# Altium schematic sheet Power Management.SchDoc: NER A Size Template
size Tabloid; ApprovedBy: WS; DrawnBy: Cameron Gordon; Address4: X.X.X; Revision: 1; SheetNumber: 2; SheetTotal: 3
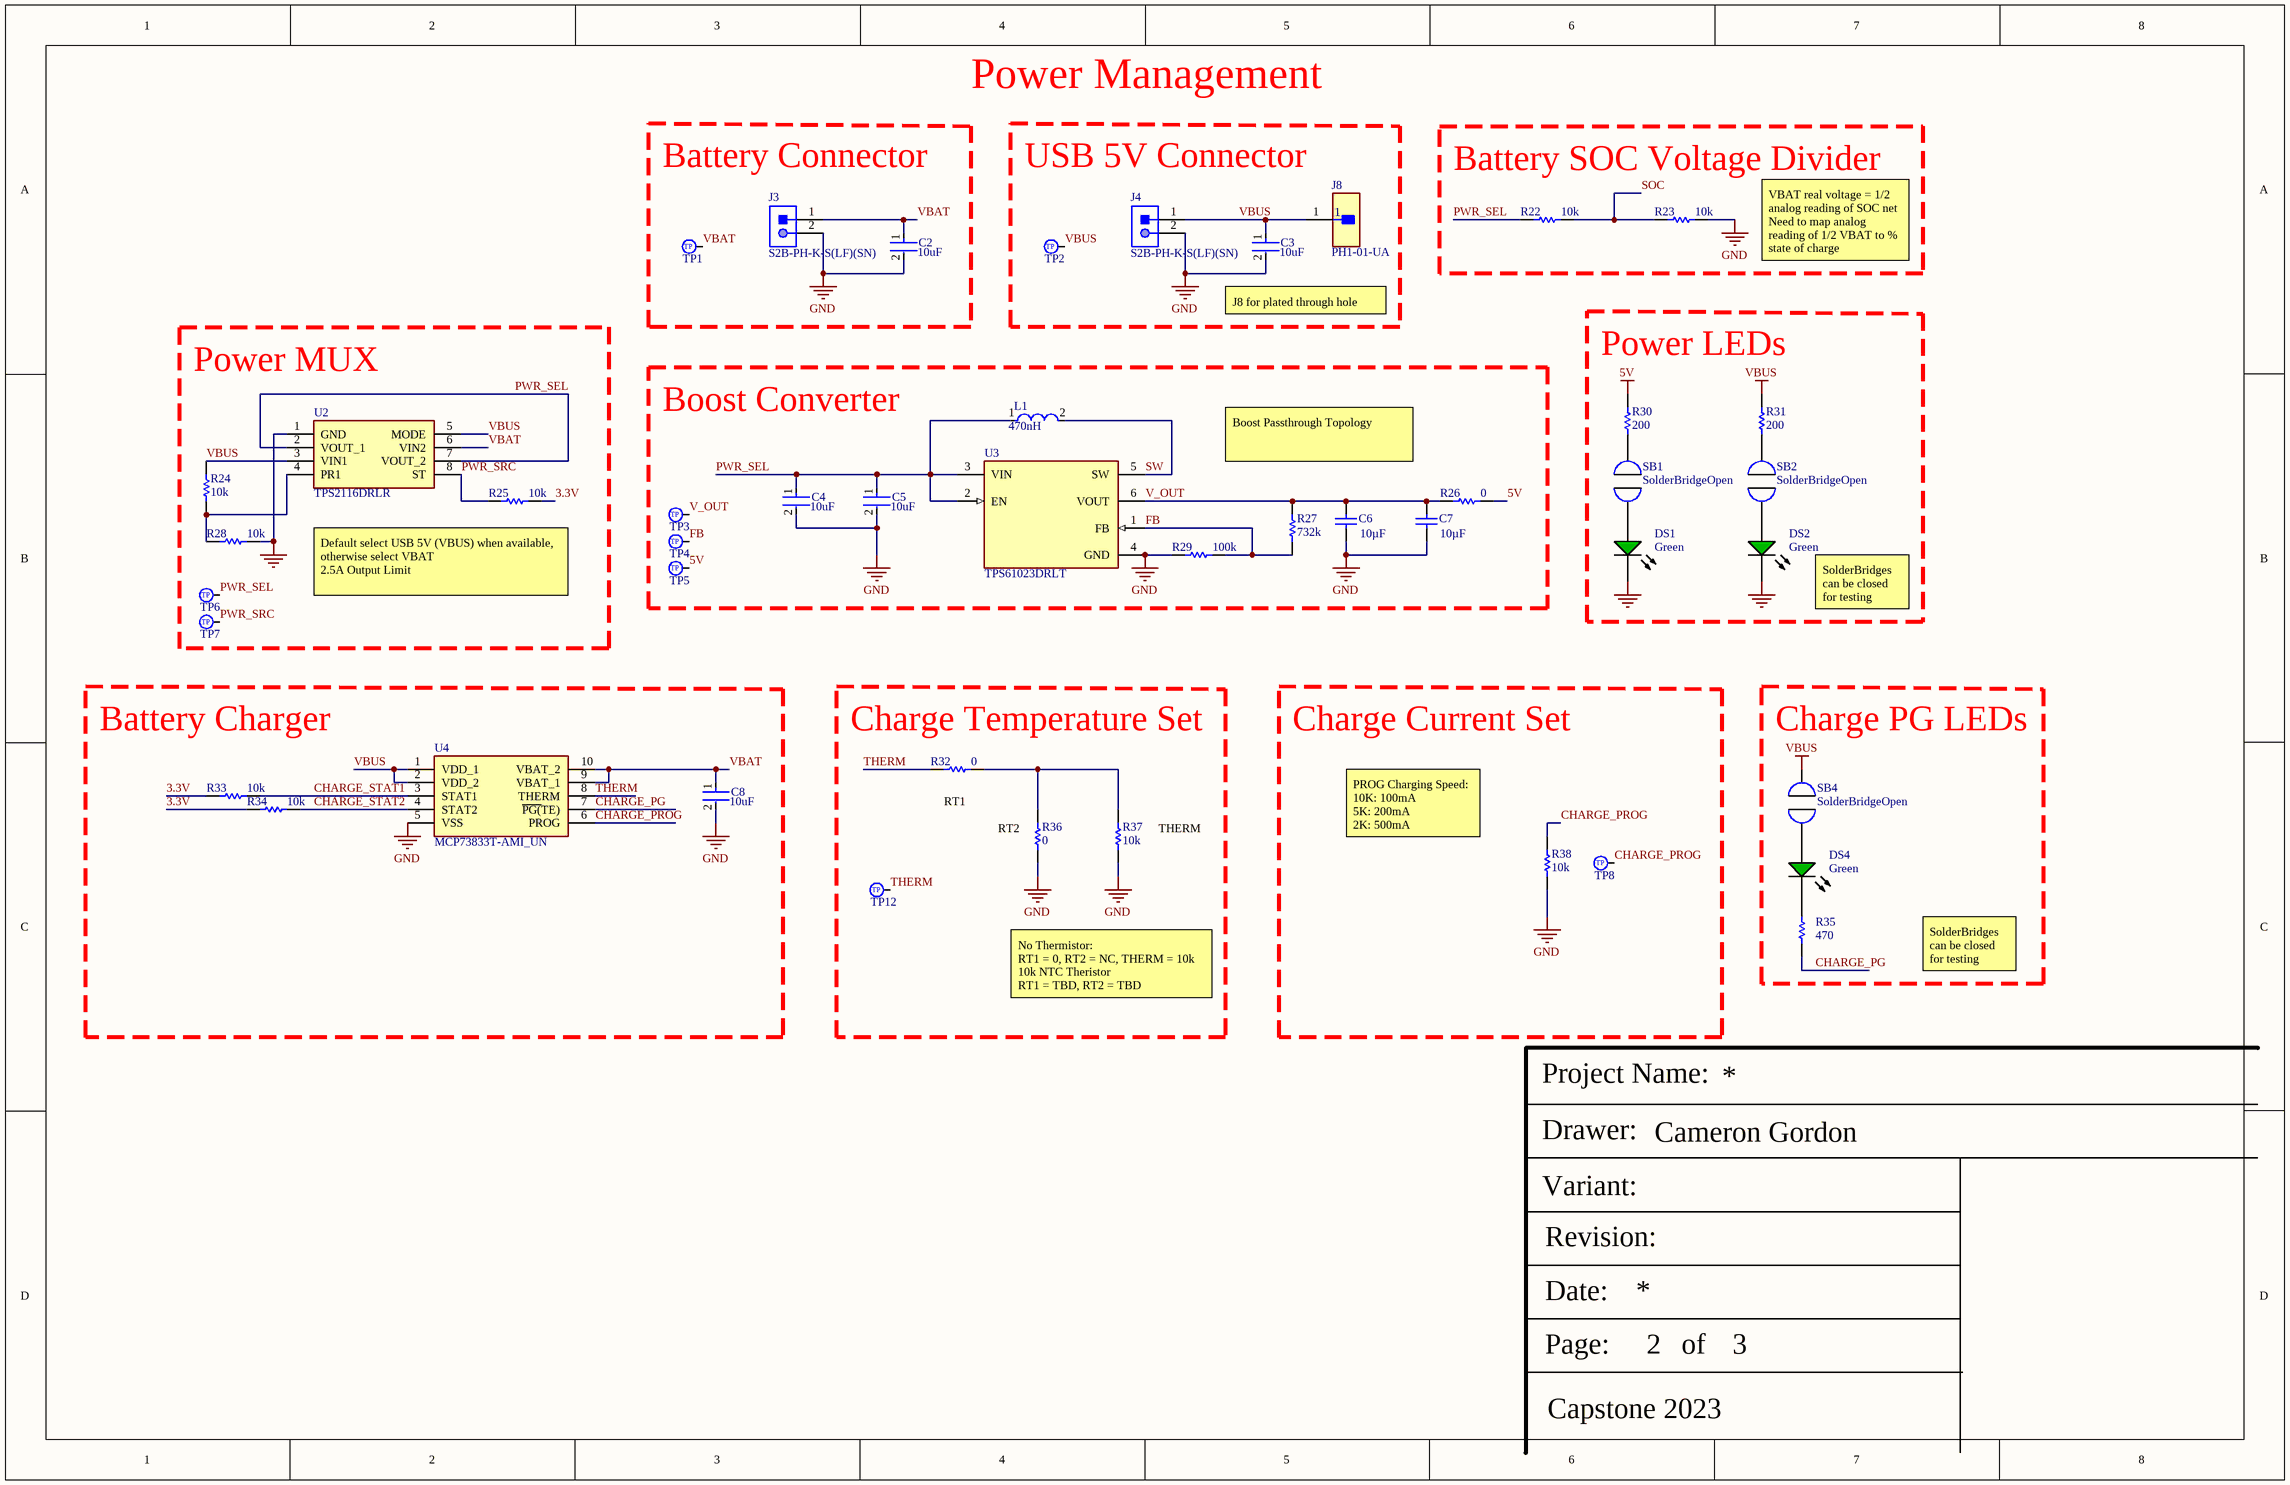
[diagram p0: Power Management.SchDoc]

## Parts
C2  value 10uF  [FP-C0805C-DG-MFG]  (hidden comment: C0805C106K8PACTU)
C3  value 10uF  [FP-C0805C-DG-MFG]  (hidden comment: C0805C106K8PACTU)
C4  value 10uF  [FP-C0805C-DG-MFG]  (hidden comment: C0805C106K8PACTU)
C5  value 10uF  [FP-C0805C-DG-MFG]  (hidden comment: C0805C106K8PACTU)
C6  Capacitance: 10µF  [CAPC3216X180X55LL20T25]  (hidden comment: GRM31CR71C106KAC7L)
C7  Capacitance: 10µF  [CAPC3216X180X55LL20T25]  (hidden comment: GRM31CR71C106KAC7L)
C8  value 10uF  [FP-C0805C-DG-MFG]  (hidden comment: C0805C106K8PACTU)
DS1  Color: Green  [LUMX-SML-LXT0805_V]  (hidden comment: SML-LXT0805GW-TR)
DS2  Color: Green  [LUMX-SML-LXT0805_V]  (hidden comment: SML-LXT0805GW-TR)
DS4  Color: Green  [LUMX-SML-LXT0805_V]  (hidden comment: SML-LXT0805GW-TR)
J3  S2B-PH-K-S(LF)(SN)  [JST-S2B-PH-K-S_V]
J4  S2B-PH-K-S(LF)(SN)  [JST-S2B-PH-K-S_V]
J8  PH1-01-UA  [FP-PH1-01-UA-MFG]
L1  Inductance: 470nH  [FP-IHLP-1212AE-11-MFG]  (hidden comment: IHLP1212AEERR47M11)
R22  Resistance: 10k  [RESC1609X55X30LL15T15]  (hidden comment: ERJ3EKF1002V)
R23  Resistance: 10k  [RESC1609X55X30LL15T15]  (hidden comment: ERJ3EKF1002V)
R24  Resistance: 10k  [RESC1609X55X30LL15T15]  (hidden comment: ERJ3EKF1002V)
R25  Resistance: 10k  [RESC1609X55X30LL15T15]  (hidden comment: ERJ3EKF1002V)
R26  Resistance: 0  [RESC1608X55X25ML10T15]  (hidden comment: RC0603JR-070RL)
R27  value 732k  [RESC1608X55X30LL15T15]  (hidden comment: ERJ-3EKF5232V)
R28  Resistance: 10k  [RESC1609X55X30LL15T15]  (hidden comment: ERJ3EKF1002V)
R29  value 100k  [RESC1608X55X30ML15T15]  (hidden comment: ERJ-3EKF1003V)
R30  value 200  [RESC2013X60X35ML10T20]  (hidden comment: RC0805JR-07200RL)
R31  value 200  [RESC2013X60X35ML10T20]  (hidden comment: RC0805JR-07200RL)
R32  Resistance: 0  [RESC1608X55X25ML10T15]  (hidden comment: RC0603JR-070RL)
R33  Resistance: 10k  [RESC1609X55X30LL15T15]  (hidden comment: ERJ3EKF1002V)
R34  Resistance: 10k  [RESC1609X55X30LL15T15]  (hidden comment: ERJ3EKF1002V)
R35  value 470  [RESC1608X55X30NL15T15]  (hidden comment: ERJ-3GEYJ471V)
R36  Resistance: 0  [RESC1608X55X25ML10T15]  (hidden comment: RC0603JR-070RL)
R37  Resistance: 10k  [RESC1609X55X30LL15T15]  (hidden comment: ERJ3EKF1002V)
R38  Resistance: 10k  [RESC1609X55X30LL15T15]  (hidden comment: ERJ3EKF1002V)
SB1  SolderBridgeOpen  [SOLDERBRIDGEOPEN]
SB2  SolderBridgeOpen  [SOLDERBRIDGEOPEN]
SB4  SolderBridgeOpen  [SOLDERBRIDGEOPEN]
TP1  0.040" Circular Test Point  [40 mil Circular Test Point]  (value not drawn)
TP2  0.040" Circular Test Point  [40 mil Circular Test Point]  (value not drawn)
TP3  0.040" Circular Test Point  [40 mil Circular Test Point]  (value not drawn)
TP4  0.040" Circular Test Point  [40 mil Circular Test Point]  (value not drawn)
TP5  0.040" Circular Test Point  [40 mil Circular Test Point]  (value not drawn)
TP6  0.040" Circular Test Point  [40 mil Circular Test Point]  (value not drawn)
TP7  0.040" Circular Test Point  [40 mil Circular Test Point]  (value not drawn)
TP8  0.040" Circular Test Point  [40 mil Circular Test Point]  (value not drawn)
TP12  0.040" Circular Test Point  [40 mil Circular Test Point]  (value not drawn)
U2  TPS2116DRLR  [SOTFL50P160X60-8N]
U3  TPS61023DRLT  [FP-DRL0006A-MFG]
U4  MCP73833T-AMI_UN  [SOP50P490X110-10N]

## Blocks framed on the sheet
Battery Connector: C2 J3 TP1
USB 5V Connector: C3 J4 J8 TP2
Battery SOC Voltage Divider: R22 R23
Power MUX: R24 R25 R28 TP6 TP7 U2
Power LEDs: DS1 DS2 R30 R31 SB1 SB2
Boost Converter: C4-C7 L1 R26 R27 R29 TP3-TP5 U3
Battery Charger: C8 R33 R34 U4
Charge Temperature Set: R32 R36 R37 TP12
Charge Current Set: R38 TP8
Charge PG LEDs: DS4 R35 SB4

## Nets
5V: R26.1 R30.2 TP5.1
GND: C2.2 C3.2 C4.2 C5.2 C6.1 C7.1 C8.2 DS1.2(K) DS2.2(K) J3.2 J4.2 R23.2 R28.2 R29.1 R36.2 R37.1 R38.1 U2.1(GND) U3.4(GND) U4.5(VSS)
VBUS: C3.1 J4.1 J8.1 R24.2 R31.2 SB4.2 TP2.1 U2.3(VIN1) U2.5(MODE) U4.1(VDD_1) U4.2(VDD_2)
3.3V: R25.2 R33.1 R34.1
CHARGE_PG: R35.1 U4.7(~{PG(}TE))
CHARGE_PROG: R38.2 TP8.1 U4.6(PROG)
CHARGE_STAT1: R33.2 U4.3(STAT1)
CHARGE_STAT2: R34.2 U4.4(STAT2)
FB: R27.1 R29.2 TP4.1 U3.1(FB)
PWR_SEL: C4.1 C5.1 L1.1 R22.1 TP6.1 U2.2(VOUT_1) U2.7(VOUT_2) U3.2(EN) U3.3(VIN)
PWR_SRC: R25.1 TP7.1 U2.8(ST)
SOC: R22.2 R23.1
SW: L1.2 U3.5(SW)
THERM: R32.2 TP12.1 U4.8(THERM)
V_OUT: C6.2 C7.2 R26.2 R27.2 TP3.1 U3.6(VOUT)
VBAT: C2.1 C8.1 J3.1 TP1.1 U2.6(VIN2) U4.9(VBAT_1) U4.10(VBAT_2)
NetDS1_1: DS1.1(A) SB1.1
NetDS2_1: DS2.1(A) SB2.1
NetDS4_1: DS4.1(A) SB4.1
NetDS4_2: DS4.2(K) R35.2
NetR24_1: R24.1 R28.1 U2.4(PR1)
NetR30_1: R30.1 SB1.2
NetR31_1: R31.1 SB2.2
NetR32_1: R32.1 R36.1 R37.2

## Notes on the sheet
- Power Management
- VBAT real voltage = 1/2 analog reading of SOC net
  Need to map analog reading of 1/2 VBAT to % state of charge
- (near C3) J8 for plated through hole
- Boost Passthrough Topology
- (near R25) Default select USB 5V (VBUS) when available, otherwise select VBAT
  2.5A Output Limit
- SolderBridges can be closed for testing
- (near R32) RT1
- (near R36) RT2
- (near R37) THERM
- PROG Charging Speed:
  10K: 100mA
  5K: 200mA
  2K: 500mA
- No Thermistor:
  RT1 = 0, RT2 = NC, THERM = 10k
  10k NTC Theristor
  RT1 = TBD, RT2 = TBD
- Project Name:
- Drawer:
- Variant:
- Revision:
- Date:
- Page:
- of
- Capstone 2023
- (in symbol CMP-00017-2) TP

## Library data of the parts
C2-C5 C8 = CMP-2007-03243-2: CAP CER 10UF 10V X5R 0805; Manufacturer: Kemet; 3DS Part Number: 220-00001; Tolerance: 10%; Temperature Coefficient: 15%; Material: Ceramic; Device Class L2: Capacitors; Device Class L1: Passive Components; ComponentLink2URL: https://content.kemet.com/datasheets/KEM_C1006_X5R_SMD.pdf; Height: 1.4mm; Lead Free: Yes; Manufacturer Part Number: C0805C106K8PACTU; Digikey Description: CAP CER 10UF 10V X5R 0805; Octopart: https://octopart.com/c0805c106k8pactu-kemet-98697; Capacitance: 10uF; Temperature Range Low: -55°C; Temperature: -55°C to +85°C; Automotive: No; Mouser Description: CAP CER 10UF 10V X5R 0805; Ipc Land Pattern Name: CAPC200125X125; Temperature Range High: +85°C; Voltage: 10V; RoHS: TRUE; Device Class L3: Ceramic Capacitors; ComponentLink2Description: Datasheet; Voltage Rating: 10V; Package: C0805C-DG; Temperature Characteristic: X5R; Category: Cap
C6 C7 = CMP-2000-06352-1: Chip Capacitor, 10 uF, +/- 10%, 16 V, -55 to 125 degC, 1206 (3216 Metric), RoHS, Tape and Reel; Manufacturer: Murata; Other Names: 490-3911-6; Product Training Modules: High-CapMultilayerCeramicCapacitors; Temperature Coefficient: X7R; Catalog Drawings: GRMSeries_1206_1.6; Featured Product: GA3SafetyRecognizedCapsandHi-CapMLCC; Online Catalog: GRMSeries; Voltage - Rated: 16V; Size / Dimension: 0.126"Lx0.063"W(3.20mmx1.60mm); Applications: GeneralPurpose; Package Description: 2-Pin Surface Mount Device, Body 3.2 x 1.6 mm; Datasheet Version: 03/2016; Package Reference: 1206; Manufacturer URL: http://www.murata.com/; Standard Package: 1; Mounting Type: SurfaceMount,MLCC; Thickness (Max): 0.071"(1.80mm); Category: Capacitors; Family: CeramicCapacitors; Lead Spacing: -; Tolerance: ±10%; Packaging: Digi-Reel®; Lead Style: -; Package / Case: 1206(3216Metric); Datasheet URL: http://search.murata.co.jp/Ceramy/image/img/A01X/G101/ENG/GRM31CR71C106KAC7-01.pdf; Operating Temperature: -55°C~125°C; Mounting Technology: SurfaceMount; Series: GRM; Ratings: -; Height - Seated (Max): -; Features: -
DS1 DS2 DS4 = CMP-1724-00001-1: LED, GREEN, 565 nm, 2 V, -25 to 80 degC, 2-Pin SMD, RoHS, Tape and Reel; Case\/Package: 0805; RoHSCompliant: true; REACH SVHC: No SVHC; Packaging: Tape and Reel; ComponentLink2URL: http://www.lumex.com/content/files/ProductAttachment/SML-LXT0805GW-TR.pdf; ComponentLink1URL: http://www.lumexinstruments.com/; Min Operating Temperature: -25 degC; Max Operating Temperature: 85 degC; DatasheetVersion: Rev. F, 09/2009; Case Code (Metric): 2012; Width: 1.25 mm; PackageDescription: 2-Pin Surface Mount Device, Body 2 x 1.25 mm; ComponentLink1Description: Manufacturer URL; Mount: Surface Mount; PackageReference: SML-LXT0805; Length: 2 mm; Case Code (Imperial): 0805; ComponentLink2Description: Datasheet; Package Quantity: 4000; Mounting Technology: Surface Mount
J3 J4 = CMP-1755-00004-1: Male Header, Pitch 2 mm, 1 x 2 Position, Height 4.8 mm, Tail Length 3.4 mm, -25 to 85 degC, RoHS, Bulk; Case\Package: Radial; Tolerance: 20%; Capacitance: 10 uF; Voltage Rating (DC): 50 V; Packaging: Bulk; ComponentLink1URL: http://www.jst-mfg.com/product/pdf/eng/ePH.pdf; Radiation Hardening: No; Height: 11 mm; Package Quantity: 200; PackageDescription: Male Header, Pitch 2 mm, 1 x 2 Position, Height 4.8 mm, Tail Length 3.4 mm; PackageReference: S2B-PH-K-S; Diameter: 5 mm; Pins: 2; Mount: Through Hole; Max Operating Temperature: 85 degC; Min Operating Temperature: -40 degC; ComponentLink1Description: Datasheet; DatasheetVersion: Dec-12; Length: 11 mm; Lead Pitch: 2 mm; REACH SVHC: No SVHC; Voltage Rating: 50 V; RoHSCompliant: true
J8 = CMP-42765-000003-1: CONN HEADER VERT 1POS 2.54MM; Number of Positions: 1; Voltage Rating (AC): 250V; Insulation Material: PBT; Number of Rows: 1; Connector Type: Header; Min Operating Temperature: -40°C; Packaging: Bulk; Contact Material: Brass; Mount: Through Hole; Contact Shape: Square; Contact Finish - Mating: GOLD; Series: PH1; Contact Type: Male Pin; Termination: Solder; Flammability Rating: UL94 V-0; Insulation Color: Black; Lead Free: Lead Free; Fastening Type: Pull; Max Operating Temperature: 105°C
L1 = CMP-02424-000856-1: FIXED IND 470NH 6.7A 15 MOHM SMD; Shielding: Shielded; DC Resistance (DCR): 15mR; Test Frequency: 100kHz; Self Resonant Frequency: 1MHz; Core Material: Ferrite; Tolerance: 20%; Depth: 3.2mm; Case/Package: Nonstandard; Packaging: Cut Tape; Number of Pins: 2; Case Code (Imperial): 1212; Height - Seated (Max): 0.059inch; RoHS Compliant: Yes; Height: 1.2mm; Military Standard: Not; Lead Free: Lead Free; Width: 0.118inch; Saturation Current: 6.7A; Radiation Hardening: No; Mount: Surface Mount; Series: IHLP-1212AE-11; Max DC Current: 6.7A; Termination: SMD/SMT; Current Rating: 6.7A; Rated Current-Max: 6.7A; RMS Current (Irms): 6.7A; Inductance Tolerance: 20%; Package Quantity: 3000; Max Operating Temperature: 125°C; Length: 0.144inch; Min Operating Temperature: -55°C
R22-R25 R28 R33 R34 R37 R38 = CMP-1012-00623-3: Chip Resistor, 10 KOhm, +/- 1%, 0.1 W, -55 to 155 degC, 0603 (1608 Metric), RoHS, Tape and Reel; Manufacturer: Panasonic; Voltage Rating: 75V; Case\/Package: 0603; Power Rating: 100mW; Temperature Coefficient: 100ppm\/degreesC; Number of Pins: 2; Package Reference: 603; Depth: 0.8mm; Mount: SurfaceMount; Package Description: 2-Pin Surface Mount Device, Body 1.6 x 0.85 mm; Datasheet Version: 02/2017; Length: 1.6mm; Lead Free: LeadFree; Height: 0.45mm; Number of Terminations: 2; Max Power Dissipation: 100mW; Min Operating Temperature: -55degC; Datasheet URL: https://industrial.panasonic.com/cdbs/www-data/pdf/RDA0000/AOA0000C304.pdf; Termination: SMD/SMT; Case Code (Metric): 1608; Case Code (Imperial): 0603; Tolerance: 1%; Max Operating Temperature: 155degC; RoHSCompliant: true; Voltage Rating (DC): 75V; Radiation Hardening: No; Packaging: TapeandReel; Composition: ThickFilm; Mounting Technology: SurfaceMount; Manufacturer URL: http://www.panasonic.com/; Width: 0.031inch; REACH SVHC: NoSVHC; Contact Plating: Tin; Military Standard: Not; Package Quantity: 1
R26 R32 R36 = CMP-2100-03667-1: Chip Resistor, 0 Ohm, +/- 5%, 0.1 W, -55 to 155 degC, 0603 (1608 Metric), RoHS, Tape and Reel; Manufacturer: Yageo; Temperature Coefficient: 200ppm/degreesC; Voltage Rating: 50V; Power Rating: 100mW; Width: 0.8mm; Max Operating Temperature: 155degC; Tolerance: 5%; Package Reference: 0603; Height: 0.45mm; Depth: 0.8mm; Package Description: 2-Pin Surface Mount Device, Body 1.6 x 0.8 mm; Termination: SMD/SMT; Package Quantity: 5000; Case/Package: 0603; Case Code (Imperial): 0603; Radiation Hardening: No; Number of Pins: 2; Length: 1.6mm; Lead Free: LeadFree; Voltage Rating (DC): 50V; Military Standard: Not; Datasheet URL: http://www.yageo.com/NewPortal/yageodocoutput?fileName=/pdf/R-Chip/PYu-RC_Group_51_RoHS_L_5.pdf; Manufacturer URL: http://www.yageo.com/; Packaging: TapeandReel; Case Code (Metric): 1608; Min Operating Temperature: -55degC; Composition: ThickFilm; RoHSCompliant: true; Contact Plating: Tin; Datasheet Version: Rev. 5, 10/2016; REACH SVHC: NoSVHC
R27 = CMP-2000-00551-1: Manufacturer: Panasonic; Part Number: ERJ-3EKF5232V
R29 = CMP-2000-00182-1: Manufacturer: Panasonic; Part Number: ERJ-3EKF1003V
R30 R31 = CMP-2001-01354-1: Manufacturer: Yageo; Part Number: RC0805JR-07200RL
R35 = CMP-2000-00795-1: Manufacturer: Panasonic; Part Number: ERJ-3GEYJ471V
TP1-TP8 TP12 = CMP-00017-2
U2 = TPS2116DRLR: Integrated Circuit; Manufacturer_Name: Texas Instruments; Datasheet Link: https://www.ti.com/lit/gpn/tps2116; Height: 0.6mm; Manufacturer_Part_Number: TPS2116DRLR; Mouser Part Number: 595-TPS2116DRLR; Mouser Price/Stock: https://www.mouser.co.uk/ProductDetail/Texas-Instruments/TPS2116DRLR?qs=aP1CjGhiNiGo3XAyXcVPaQ%3D%3D; Arrow Part Number: TPS2116DRLR; Arrow Price/Stock: https://www.arrow.com/en/products/tps2116drlr/texas-instruments?region=nac
U3 = CMP-04918-000657-1: IC REG BOOST ADJ 3A SOT563
U4 = MCP73833T-AMI_UN: Integrated Circuit; Manufacturer_Name: Microchip; Manufacturer_Part_Number: MCP73833T-AMI/UN; Datasheet Link: https://datasheet.datasheetarchive.com/originals/distributors/Datasheets-DGA15/727183.pdf; Height: 1.1mm; Mouser Part Number: 579-MCP73833T-AMI/UN; Mouser Price/Stock: https://www.mouser.co.uk/ProductDetail/Microchip-Technology/MCP73833T-AMI-UN?qs=Fxu3fLyJv8cZVyNfuXhl2Q%3D%3D; Arrow Part Number: MCP73833T-AMI/UN; Arrow Price/Stock: https://www.arrow.com/en/products/mcp73833t-amiun/microchip-technology?region=nac